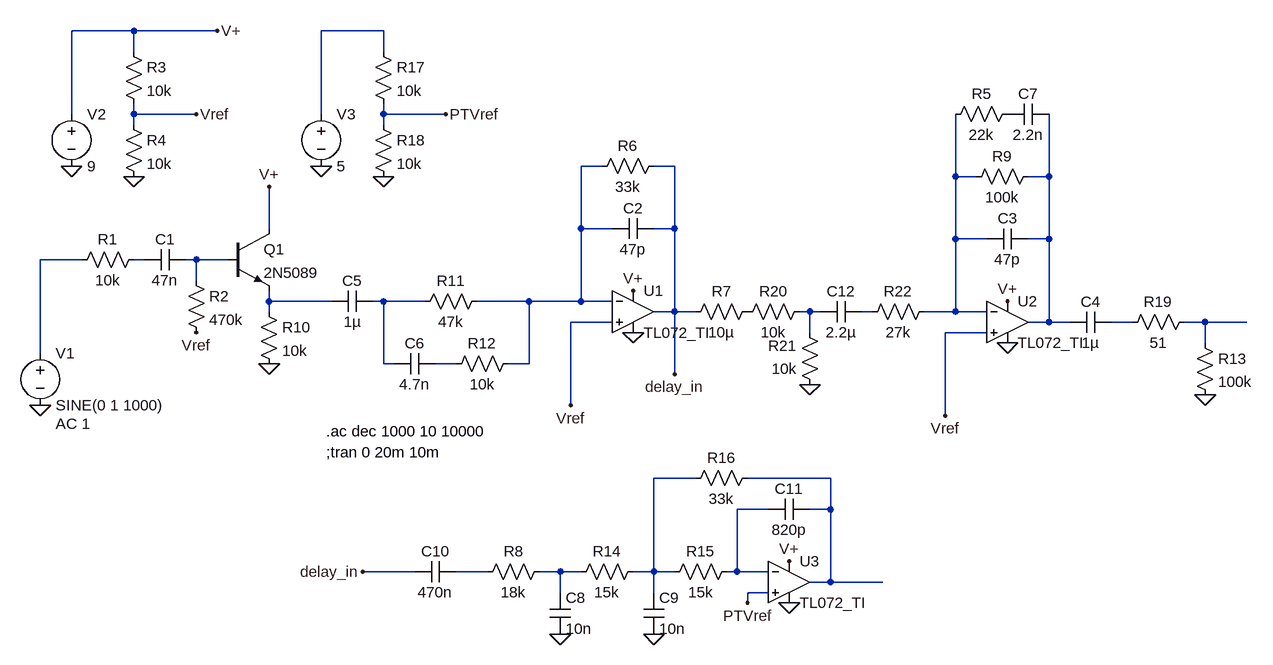
[diagram p0: schematic sentinel_filters.asc]
sentinel_filters.asc, the LTspice schematic file:
Version 4
SHEET 1 1988 692
WIRE 256 -320 160 -320
WIRE 384 -320 256 -320
WIRE 640 -320 544 -320
WIRE 256 -288 256 -320
WIRE 640 -288 640 -320
WIRE 160 -192 160 -320
WIRE 256 -192 256 -208
WIRE 352 -192 256 -192
WIRE 544 -192 544 -320
WIRE 640 -192 640 -208
WIRE 736 -192 640 -192
WIRE 256 -176 256 -192
WIRE 640 -176 640 -192
WIRE 976 -112 944 -112
WIRE 1088 -112 1056 -112
WIRE 1520 -96 1520 -192
WIRE 1552 -96 1520 -96
WIRE 1664 -96 1664 -192
WIRE 1664 -96 1632 -96
WIRE 464 -16 464 -80
WIRE 944 -16 944 -112
WIRE 992 -16 944 -16
WIRE 1088 -16 1088 -112
WIRE 1088 -16 1056 -16
WIRE 1520 0 1520 -96
WIRE 1568 0 1520 0
WIRE 1664 0 1664 -96
WIRE 1664 0 1632 0
WIRE 176 32 112 32
WIRE 272 32 256 32
WIRE 352 32 336 32
WIRE 400 32 352 32
WIRE 352 64 352 32
WIRE 464 96 464 80
WIRE 560 96 464 96
WIRE 640 96 624 96
WIRE 704 96 640 96
WIRE 864 96 784 96
WIRE 944 96 944 -16
WIRE 944 96 864 96
WIRE 992 96 944 96
WIRE 464 112 464 96
WIRE 1088 112 1088 -16
WIRE 1088 112 1056 112
WIRE 1120 112 1088 112
WIRE 1296 112 1280 112
WIRE 1312 112 1296 112
WIRE 1392 112 1376 112
WIRE 1520 112 1520 0
WIRE 1520 112 1472 112
WIRE 1568 112 1520 112
WIRE 992 128 928 128
WIRE 1664 128 1664 0
WIRE 1664 128 1632 128
WIRE 1696 128 1664 128
WIRE 1792 128 1760 128
WIRE 1904 128 1872 128
WIRE 1968 128 1904 128
WIRE 1296 144 1296 112
WIRE 1568 144 1504 144
WIRE 1904 160 1904 128
WIRE 112 176 112 32
WIRE 640 192 640 96
WIRE 656 192 640 192
WIRE 752 192 720 192
WIRE 864 192 864 96
WIRE 864 192 832 192
WIRE 1088 208 1088 112
WIRE 928 256 928 128
WIRE 1504 272 1504 144
WIRE 1120 368 1056 368
WIRE 1328 368 1200 368
WIRE 1232 416 1184 416
WIRE 1328 416 1328 368
WIRE 1328 416 1296 416
WIRE 688 512 608 512
WIRE 800 512 752 512
WIRE 912 512 880 512
WIRE 944 512 912 512
WIRE 1056 512 1056 368
WIRE 1056 512 1024 512
WIRE 1088 512 1056 512
WIRE 1184 512 1184 416
WIRE 1184 512 1168 512
WIRE 1232 512 1184 512
WIRE 1328 528 1328 416
WIRE 1328 528 1296 528
WIRE 1408 528 1328 528
WIRE 912 544 912 512
WIRE 1056 544 1056 512
WIRE 1232 544 1200 544
WIRE 1200 560 1200 544
FLAG 112 256 0
FLAG 160 -112 0
FLAG 256 -96 0
FLAG 384 -320 V+
FLAG 352 -192 Vref
FLAG 1024 80 V+
FLAG 928 256 Vref
FLAG 1024 144 0
FLAG 1600 96 V+
FLAG 1504 272 Vref
FLAG 1600 160 0
FLAG 464 -80 V+
FLAG 464 192 0
FLAG 352 144 Vref
FLAG 1904 240 0
FLAG 1088 208 delay_in
FLAG 912 608 0
FLAG 1056 608 0
FLAG 608 512 delay_in
FLAG 1200 560 PTVref
FLAG 1264 496 V+
FLAG 1264 560 0
FLAG 544 -112 0
FLAG 640 -96 0
FLAG 736 -192 PTVref
FLAG 1296 224 0
SYMBOL voltage 112 160 R0
WINDOW 123 24 124 Left 2
WINDOW 39 0 0 Left 2
SYMATTR Value2 AC 1
SYMATTR InstName V1
SYMATTR Value SINE(0 1 1000)
SYMBOL EXTRA\\AudioOpamp\\TI\\TL072_TI 1024 112 R0
SYMATTR InstName U1
SYMBOL voltage 160 -208 R0
WINDOW 123 0 0 Left 2
WINDOW 39 0 0 Left 2
SYMATTR InstName V2
SYMATTR Value 9
SYMBOL res 240 -304 R0
SYMATTR InstName R3
SYMATTR Value 10k
SYMBOL res 240 -192 R0
SYMATTR InstName R4
SYMATTR Value 10k
SYMBOL cap 1056 -32 R90
WINDOW 0 0 32 VBottom 2
WINDOW 3 32 32 VTop 2
SYMATTR InstName C2
SYMATTR Value 47p
SYMBOL res 1072 -128 R90
WINDOW 0 0 56 VBottom 2
WINDOW 3 32 56 VTop 2
SYMATTR InstName R6
SYMATTR Value 33k
SYMBOL res 1216 96 R90
WINDOW 0 0 56 VBottom 2
WINDOW 3 32 56 VTop 2
SYMATTR InstName R7
SYMATTR Value 10µ
SYMBOL EXTRA\\AudioOpamp\\TI\\TL072_TI 1600 128 R0
SYMATTR InstName U2
SYMBOL cap 1632 -16 R90
WINDOW 0 0 32 VBottom 2
WINDOW 3 32 32 VTop 2
SYMATTR InstName C3
SYMATTR Value 47p
SYMBOL res 1648 -112 R90
WINDOW 0 0 56 VBottom 2
WINDOW 3 32 56 VTop 2
SYMATTR InstName R9
SYMATTR Value 100k
SYMBOL cap 1760 112 R90
WINDOW 0 0 32 VBottom 2
WINDOW 3 32 32 VTop 2
SYMATTR InstName C4
SYMATTR Value 1µ
SYMBOL res 272 16 R90
WINDOW 0 0 56 VBottom 2
WINDOW 3 32 56 VTop 2
SYMATTR InstName R1
SYMATTR Value 10k
SYMBOL cap 336 16 R90
WINDOW 0 0 32 VBottom 2
WINDOW 3 32 32 VTop 2
SYMATTR InstName C1
SYMATTR Value 47n
SYMBOL res 336 48 R0
SYMATTR InstName R2
SYMATTR Value 470k
SYMBOL npn 400 -16 R0
SYMATTR InstName Q1
SYMATTR Value 2N5089
SYMBOL res 448 96 R0
SYMATTR InstName R10
SYMATTR Value 10k
SYMBOL cap 624 80 R90
WINDOW 0 0 32 VBottom 2
WINDOW 3 32 32 VTop 2
SYMATTR InstName C5
SYMATTR Value 1µ
SYMBOL res 800 80 R90
WINDOW 0 0 56 VBottom 2
WINDOW 3 32 56 VTop 2
SYMATTR InstName R11
SYMATTR Value 47k
SYMBOL cap 720 176 R90
WINDOW 0 0 32 VBottom 2
WINDOW 3 32 32 VTop 2
SYMATTR InstName C6
SYMATTR Value 4.7n
SYMBOL res 848 176 R90
WINDOW 0 0 56 VBottom 2
WINDOW 3 32 56 VTop 2
SYMATTR InstName R12
SYMATTR Value 10k
SYMBOL res 1616 -208 R90
WINDOW 0 0 56 VBottom 2
WINDOW 3 32 56 VTop 2
SYMATTR InstName R5
SYMATTR Value 22k
SYMBOL cap 1664 -208 R90
WINDOW 0 0 32 VBottom 2
WINDOW 3 32 32 VTop 2
SYMATTR InstName C7
SYMATTR Value 2.2n
SYMBOL res 1888 144 R0
SYMATTR InstName R13
SYMATTR Value 100k
SYMBOL res 896 496 R90
WINDOW 0 0 56 VBottom 2
WINDOW 3 32 56 VTop 2
SYMATTR InstName R8
SYMATTR Value 18k
SYMBOL cap 896 544 R0
SYMATTR InstName C8
SYMATTR Value 10n
SYMBOL res 1040 496 R90
WINDOW 0 0 56 VBottom 2
WINDOW 3 32 56 VTop 2
SYMATTR InstName R14
SYMATTR Value 15k
SYMBOL cap 1040 544 R0
SYMATTR InstName C9
SYMATTR Value 10n
SYMBOL res 1184 496 R90
WINDOW 0 0 56 VBottom 2
WINDOW 3 32 56 VTop 2
SYMATTR InstName R15
SYMATTR Value 15k
SYMBOL cap 752 496 R90
WINDOW 0 0 32 VBottom 2
WINDOW 3 32 32 VTop 2
SYMATTR InstName C10
SYMATTR Value 470n
SYMBOL EXTRA\\AudioOpamp\\TI\\TL072_TI 1264 528 R0
SYMATTR InstName U3
SYMBOL cap 1296 400 R90
WINDOW 0 0 32 VBottom 2
WINDOW 3 32 32 VTop 2
SYMATTR InstName C11
SYMATTR Value 820p
SYMBOL res 1216 352 R90
WINDOW 0 0 56 VBottom 2
WINDOW 3 32 56 VTop 2
SYMATTR InstName R16
SYMATTR Value 33k
SYMBOL voltage 544 -208 R0
WINDOW 123 0 0 Left 2
WINDOW 39 0 0 Left 2
SYMATTR InstName V3
SYMATTR Value 5
SYMBOL res 624 -304 R0
SYMATTR InstName R17
SYMATTR Value 10k
SYMBOL res 624 -192 R0
SYMATTR InstName R18
SYMATTR Value 10k
SYMBOL res 1888 112 R90
WINDOW 0 0 56 VBottom 2
WINDOW 3 32 56 VTop 2
SYMATTR InstName R19
SYMATTR Value 51
SYMBOL res 1296 96 R90
WINDOW 0 0 56 VBottom 2
WINDOW 3 32 56 VTop 2
SYMATTR InstName R20
SYMATTR Value 10k
SYMBOL res 1312 240 R180
WINDOW 0 36 76 Left 2
WINDOW 3 36 40 Left 2
SYMATTR InstName R21
SYMATTR Value 10k
SYMBOL cap 1376 96 R90
WINDOW 0 0 32 VBottom 2
WINDOW 3 32 32 VTop 2
SYMATTR InstName C12
SYMATTR Value 2.2µ
SYMBOL res 1488 96 R90
WINDOW 0 0 56 VBottom 2
WINDOW 3 32 56 VTop 2
SYMATTR InstName R22
SYMATTR Value 27k
TEXT 552 296 Left 2 !.ac dec 1000 10 10000
TEXT 552 328 Left 2 !;tran 0 20m 10m

The netlist it stands for:
* sentinel_filters.asc
V1 N005 0 SINE(0 1 1000) AC 1
* U1: TL072_TI (symbol EXTRA\AudioOpamp\TI\TL072_TI not available, pins judged from their places): In+=Vref In-=N002 V+=V+ V-=0 OUT=delay_in
V2 V+ 0 9
R3 V+ Vref 10k
R4 Vref 0 10k
C2 delay_in N002 47p
R6 delay_in N002 33k
R7 P001 delay_in 10µ
* U2: TL072_TI (symbol EXTRA\AudioOpamp\TI\TL072_TI not available, pins judged from their places): In+=Vref In-=N003 V+=V+ V-=0 OUT=N004
C3 N004 N003 47p
R9 N004 N003 100k
C4 N012 N004 1µ
R1 N006 N005 10k
C1 N007 N006 47n
R2 N007 Vref 470k
Q1 V+ N007 N008 0 2N5089
R10 N008 0 10k
C5 N009 N008 1µ
R11 N002 N009 47k
C6 N014 N009 4.7n
R12 N002 N014 10k
R5 P002 N003 22k
C7 N004 P002 2.2n
R13 N013 0 100k
R8 N019 N018 18k
C8 N019 0 10n
R14 N015 N019 15k
C9 N015 0 10n
R15 N017 N015 15k
C10 N018 delay_in 470n
* U3: TL072_TI (symbol EXTRA\AudioOpamp\TI\TL072_TI not available, pins judged from their places): In+=PTVref In-=N017 V+=V+ V-=0 OUT=N016
C11 N016 N017 820p
R16 N016 N015 33k
V3 N001 0 5
R17 N001 PTVref 10k
R18 PTVref 0 10k
R19 N013 N012 51
R20 N010 P001 10k
R21 0 N010 10k
C12 N011 N010 2.2µ
R22 N003 N011 27k
.model NPN NPN
.model PNP PNP
.lib standard.bjt
.ac dec 1000 10 10000
;tran 0 20m 10m
.backanno
.end